# EAGLE design controller_v5 (EAGLE 7.1.0)

## Sheet 1 of 4
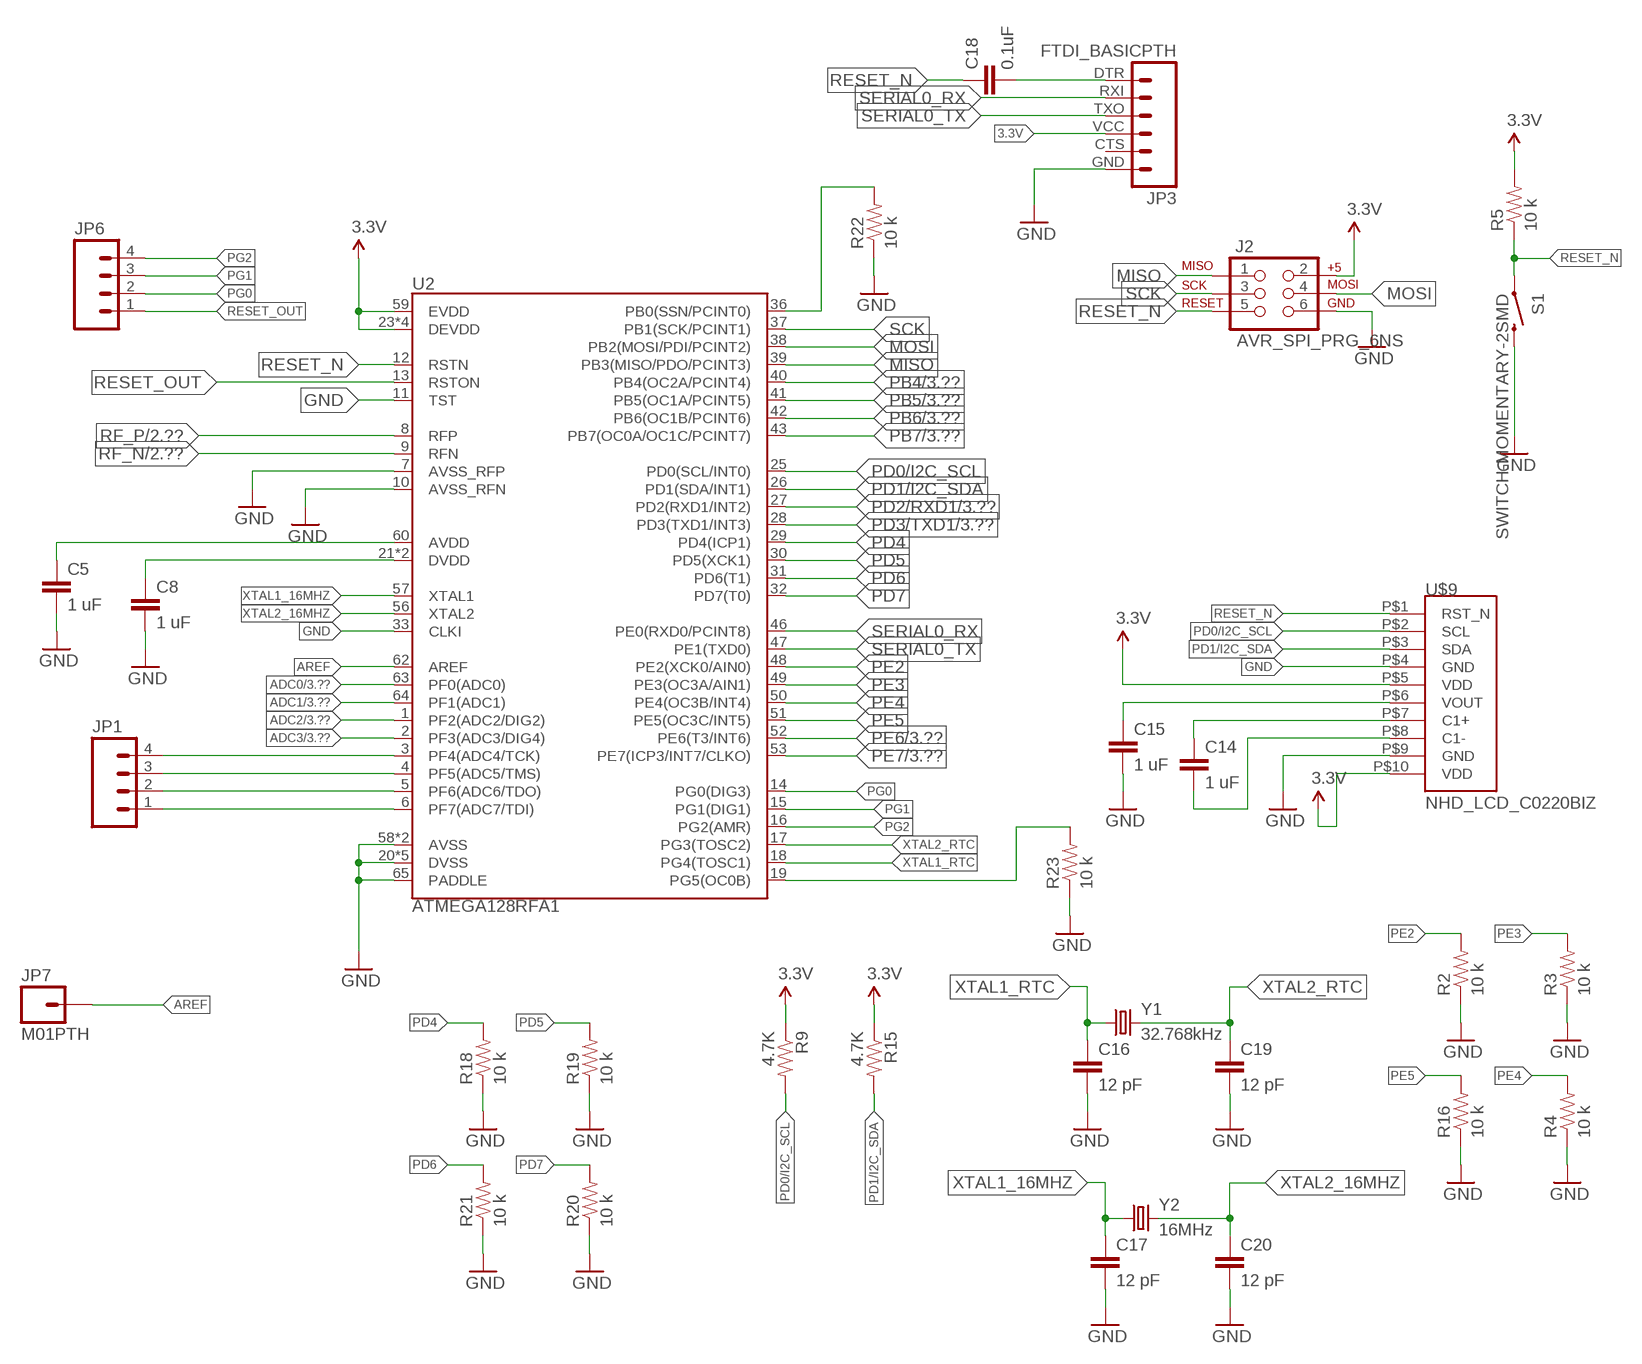
[diagram p0: schematic, sheet 1]

### Parts
C5  1 uF  CAP0805  [0805]
C8  1 uF  CAP0805  [0805]
C14  1 uF  CAP0805  [0805]
C15  1 uF  CAP0805  [0805]
C16  12 pF  CAP0805  [0805]
C17  12 pF  CAP0805  [0805]
C18  0.1uF  CAP0805  [0805]
C19  12 pF  CAP0805  [0805]
C20  12 pF  CAP0805  [0805]
J2  AVR_SPI_PRG_6NS  [2X3-NS]
JP1  M04PTH  [1X04]
JP3  FTDI_BASICPTH  [FTDI_BASIC]
JP6  M04PTH  [1X04]
JP7  M01PTH  [1X01]
R2  10 k  RESISTOR0805-RES  [0805]
R3  10 k  RESISTOR0805-RES  [0805]
R4  10 k  RESISTOR0805-RES  [0805]
R5  10 k  RESISTOR0805-RES  [0805]
R9  4.7K  RESISTOR0805-RES  [0805]
R15  4.7K  RESISTOR0805-RES  [0805]
R16  10 k  RESISTOR0805-RES  [0805]
R18  10 k  RESISTOR0805-RES  [0805]
R19  10 k  RESISTOR0805-RES  [0805]
R20  10 k  RESISTOR0805-RES  [0805]
R21  10 k  RESISTOR0805-RES  [0805]
R22  10 k  RESISTOR0805-RES  [0805]
R23  10 k  RESISTOR0805-RES  [0805]
S1  SWITCH-MOMENTARY-2SMD  [TACTILE_SWITCH_SMD]
U2  ATMEGA128RFA1  [QFN-64]
U$9  NHD_LCD_C0220BIZ  [1X08-2MMPTH-LCD]
Y1  32.768kHz  CRYSTAL32-SMD  [CRYSTAL-32KHZ-SMD]
Y2  16MHz  CRYSTAL5X3  [CRYSTAL-SMD-5X3]

### Nets
3.3V: J2.2 JP3.VCC R5.2 R9.1 R15.1 U2.23(DEVDD) U2.34(DEVDD) U2.44(DEVDD) U2.54(DEVDD) U2.59(EVDD) U$9.P$5(VDD) U$9.P$10(VDD) ; also sheet 3,4
ADC0: U2.63(PF0(ADC0)) ; also sheet 3
ADC1: U2.64(PF1(ADC1)) ; also sheet 3
ADC2: U2.1(PF2(ADC2/DIG2)) ; also sheet 3
ADC3: U2.2(PF3(ADC3/DIG4)) ; also sheet 3
ADC4: JP1.4 U2.3(PF4(ADC4/TCK))
ADC5: JP1.3 U2.4(PF5(ADC5/TMS))
ADC6: JP1.2 U2.5(PF6(ADC6/TDO))
ADC7: JP1.1 U2.6(PF7(ADC7/TDI))
AREF: JP7.1 U2.62(AREF)
GND: C5.2 C8.2 C15.2 C16.2 C17.2 C19.2 C20.2 J2.6 JP3.GND R2.1 R3.1 R4.1 R16.1 R18.1 R19.1 R20.1 R21.1 R22.1 R23.1 S1.3 U2.7(AVSS_RFP) U2.10(AVSS_RFN) U2.11(TST) U2.20(DVSS) U2.24(DVSS) U2.33(CLKI) U2.35(DVSS) U2.45(DVSS) U2.55(DVSS) U2.58(AVSS) U2.61(AVSS) U2.65(PADDLE) U$9.P$4(GND) U$9.P$9(GND) ; also sheet 2,3,4
MISO: J2.1 U2.39(PB3(MISO/PDO/PCINT3))
MOSI: J2.4 U2.38(PB2(MOSI/PDI/PCINT2))
N$2: C18.2 JP3.DTR
N$5: C14.1 U$9.P$7(C1+)
N$15: C5.1 U2.60(AVDD)
N$16: C8.1 U2.21(DVDD) U2.22(DVDD)
N$22: C14.2 U$9.P$8(C1-)
PB0: R22.2 U2.36(PB0(SSN/PCINT0))
PB1: R23.2 U2.19(PG5(OC0B))
PB4: U2.40(PB4(OC2A/PCINT4)) ; also sheet 3
PB5: U2.41(PB5(OC1A/PCINT5)) ; also sheet 3
PB6: U2.42(PB6(OC1B/PCINT6)) ; also sheet 3
PB7: U2.43(PB7(OC0A/OC1C/PCINT7)) ; also sheet 3
PD0/I2C_SCL: R9.2 U2.25(PD0(SCL/INT0)) U$9.P$2(SCL)
PD1/I2C_SDA: R15.2 U2.26(PD1(SDA/INT1)) U$9.P$3(SDA)
PD2/RXD1: U2.27(PD2(RXD1/INT2)) ; also sheet 3
PD3/TXD1: U2.28(PD3(TXD1/INT3)) ; also sheet 3
PD4: R18.2 U2.29(PD4(ICP1))
PD5: R19.2 U2.30(PD5(XCK1))
PD6: R21.2 U2.31(PD6(T1))
PD7: R20.2 U2.32(PD7(T0))
PE2: R2.2 U2.48(PE2(XCK0/AIN0))
PE3: R3.2 U2.49(PE3(OC3A/AIN1))
PE4: R4.2 U2.50(PE4(OC3B/INT4))
PE5: R16.2 U2.51(PE5(OC3C/INT5))
PE6: U2.52(PE6(T3/INT6)) ; also sheet 3
PE7: U2.53(PE7(ICP3/INT7/CLKO)) ; also sheet 3
PG0: JP6.2 U2.14(PG0(DIG3))
PG1: JP6.3 U2.15(PG1(DIG1))
PG2: JP6.4 U2.16(PG2(AMR))
RESET_N: C18.1 J2.5 R5.1 S1.1 U2.12(RSTN) U$9.P$1(RST_N)
RESET_OUT: JP6.1 U2.13(RSTON)
RF_N: U2.9(RFN) ; also sheet 2
RF_P: U2.8(RFP) ; also sheet 2
SCK: J2.3 U2.37(PB1(SCK/PCINT1))
SERIAL0_RX: JP3.RXI U2.46(PE0(RXD0/PCINT8))
SERIAL0_TX: JP3.TXO U2.47(PE1(TXD0))
VOUT: C15.1 U$9.P$6(VOUT)
XTAL1_16MHZ: C17.1 U2.57(XTAL1) Y2.1
XTAL1_RTC: C16.1 U2.18(PG4(TOSC1)) Y1.X1
XTAL2_16MHZ: C20.1 U2.56(XTAL2) Y2.3
XTAL2_RTC: C19.1 U2.17(PG3(TOSC2)) Y1.X2
Unconnected: JP3.CTS

## Sheet 2 of 4
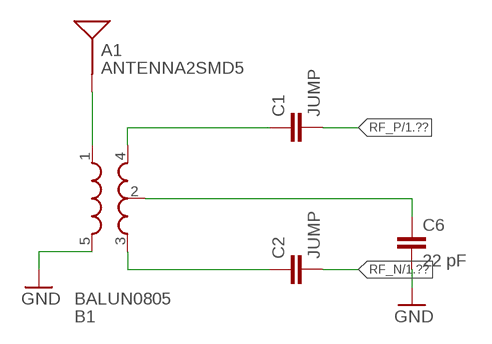
[diagram p1: schematic, sheet 2]

### Parts
A1  ANTENNA2SMD5  [ANTENNA-CHIP5]
B1  BALUN0805  [BALUN]
C1  JUMP  CAP0805  [0805]
C2  JUMP  CAP0805  [0805]
C6  22 pF  CAP0805  [0805]

### Nets
GND: B1.5(GND) C6.2 ; also sheet 1,3,4
N$9: B1.4(OUT1) C1.1
N$10: B1.3(OUT2) C2.1
N$11: B1.2(GND) C6.1
N$12: A1.FEED(SIGNAL) B1.1(IN)
RF_N: C2.2 ; also sheet 1
RF_P: C1.2 ; also sheet 1

## Sheet 3 of 4
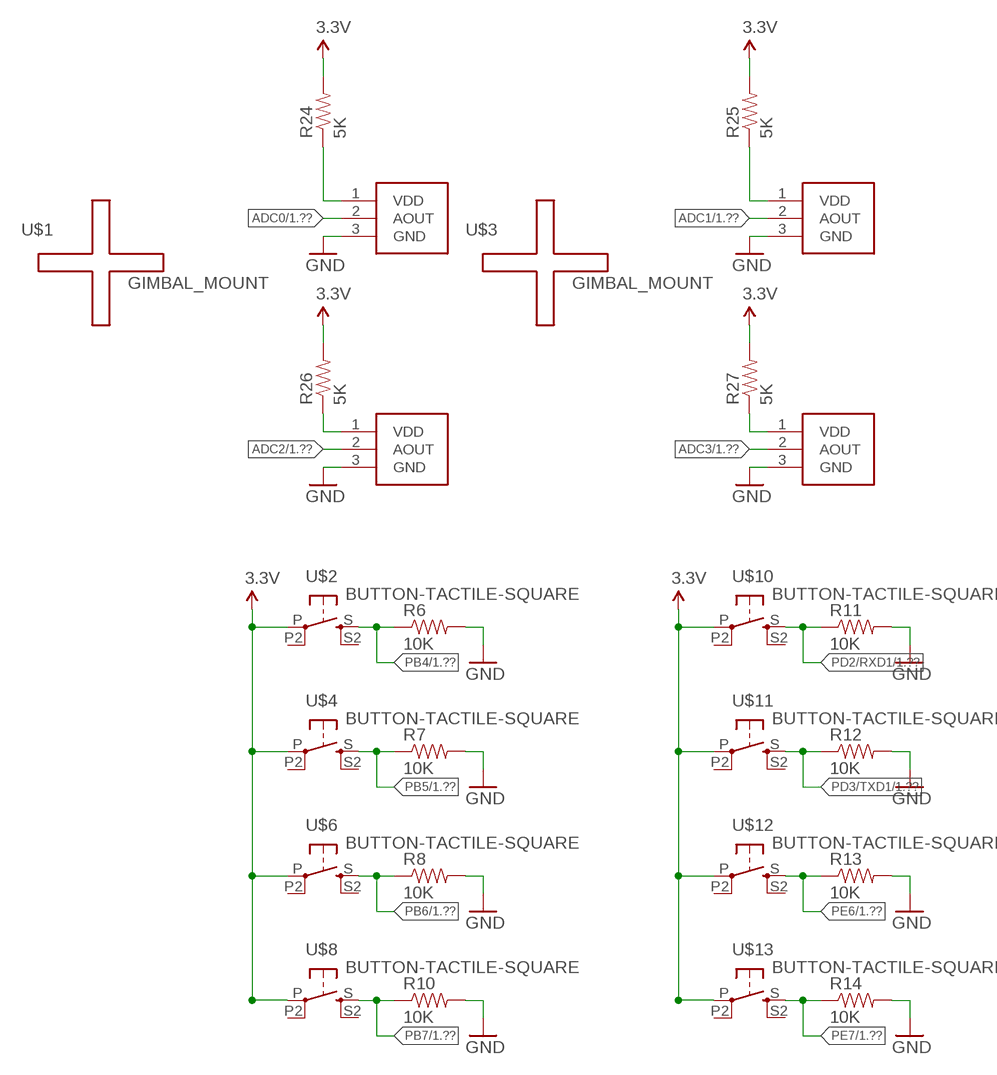
[diagram p2: schematic, sheet 3]

### Parts
J3  GIMBAL_3PIN  [JST-3-PTH]
J4  GIMBAL_3PIN  [JST-3-PTH]
J5  GIMBAL_3PIN  [JST-3-PTH]
J6  GIMBAL_3PIN  [JST-3-PTH]
R6  10K  RESISTOR0805-RES  [0805]
R7  10K  RESISTOR0805-RES  [0805]
R8  10K  RESISTOR0805-RES  [0805]
R10  10K  RESISTOR0805-RES  [0805]
R11  10K  RESISTOR0805-RES  [0805]
R12  10K  RESISTOR0805-RES  [0805]
R13  10K  RESISTOR0805-RES  [0805]
R14  10K  RESISTOR0805-RES  [0805]
R24  5K  RESISTOR0805-RES  [0805]
R25  5K  RESISTOR0805-RES  [0805]
R26  5K  RESISTOR0805-RES  [0805]
R27  5K  RESISTOR0805-RES  [0805]
U$1  GIMBAL_MOUNT  [GIMBAL_FOOTPRINT]
U$2  BUTTON-TACTILE-SQUARE  [BUTTON-TACTILE-SQUARE-ADAFRUIT1010]
U$3  GIMBAL_MOUNT  [GIMBAL_FOOTPRINT]
U$4  BUTTON-TACTILE-SQUARE  [BUTTON-TACTILE-SQUARE-ADAFRUIT1010]
U$6  BUTTON-TACTILE-SQUARE  [BUTTON-TACTILE-SQUARE-ADAFRUIT1010]
U$8  BUTTON-TACTILE-SQUARE  [BUTTON-TACTILE-SQUARE-ADAFRUIT1010]
U$10  BUTTON-TACTILE-SQUARE  [BUTTON-TACTILE-SQUARE-ADAFRUIT1010]
U$11  BUTTON-TACTILE-SQUARE  [BUTTON-TACTILE-SQUARE-ADAFRUIT1010]
U$12  BUTTON-TACTILE-SQUARE  [BUTTON-TACTILE-SQUARE-ADAFRUIT1010]
U$13  BUTTON-TACTILE-SQUARE  [BUTTON-TACTILE-SQUARE-ADAFRUIT1010]

### Nets
3.3V: R24.2 R25.2 R26.2 R27.2 U$2.P U$4.P U$6.P U$8.P U$10.P U$11.P U$12.P U$13.P ; also sheet 1,4
ADC0: J6.2(AOUT) ; also sheet 1
ADC1: J3.2(AOUT) ; also sheet 1
ADC2: J5.2(AOUT) ; also sheet 1
ADC3: J4.2(AOUT) ; also sheet 1
GND: J3.3(GND) J4.3(GND) J5.3(GND) J6.3(GND) R6.2 R7.2 R8.2 R10.2 R11.2 R12.2 R13.2 R14.2 ; also sheet 1,2,4
N$1: J6.1(VDD) R24.1
N$3: J3.1(VDD) R25.1
N$4: J5.1(VDD) R26.1
N$6: J4.1(VDD) R27.1
PB4: R6.1 U$2.S ; also sheet 1
PB5: R7.1 U$4.S ; also sheet 1
PB6: R8.1 U$6.S ; also sheet 1
PB7: R10.1 U$8.S ; also sheet 1
PD2/RXD1: R11.1 U$10.S ; also sheet 1
PD3/TXD1: R12.1 U$11.S ; also sheet 1
PE6: R13.1 U$12.S ; also sheet 1
PE7: R14.1 U$13.S ; also sheet 1
Unconnected: U$2.P2(P1) U$2.S2(S1) U$4.P2(P1) U$4.S2(S1) U$6.P2(P1) U$6.S2(S1) U$8.P2(P1) U$8.S2(S1) U$10.P2(P1) U$10.S2(S1) U$11.P2(P1) U$11.S2(S1) U$12.P2(P1) U$12.S2(S1) U$13.P2(P1) U$13.S2(S1)

## Sheet 4 of 4
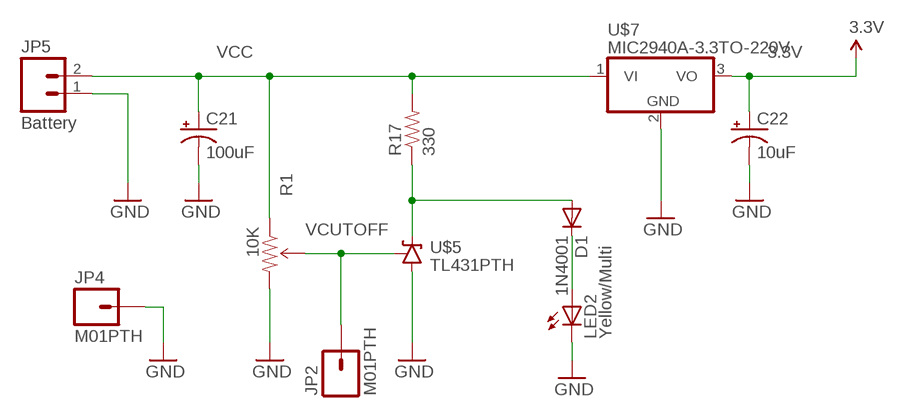
[diagram p3: schematic, sheet 4]

### Parts
C21  100uF  CPOL-USE3.5-8  [E3,5-8]
C22  10uF  CPOL-USE2.5-5  [E2,5-5]
D1  1N4001  1N4004  [DO41-10]
JP2  M01PTH  [1X01]
JP4  M01PTH  [1X01]
JP5  Battery  M02PTH  [1X02]
LED2  Yellow/Multi  LED5MM  [LED5MM]
R1  10K  TRIMPOT-PTH-KNOB  [3386U]
R17  330  RESISTORAXIAL-0.3  [AXIAL-0.3]
U$5  TL431PTH  [TO-92]
U$7  MIC2940A-3.3TO-220V  [TO-220V]

### Nets
3.3V: C22.+ U$7.3(VO) ; also sheet 1,3
GND: C21.- C22.- JP4.1 JP5.1 LED2.K(C) R1.3(CW) U$5.2(A) U$7.2(GND) ; also sheet 1,2,3
N$20: D1.A R17.P$1 U$5.3(C)
N$21: D1.C LED2.A
VCC: C21.+ JP5.2 R1.1(CCW) R17.P$2 U$7.1(VI)
VCUTOFF: JP2.1 R1.2(WIPER) U$5.1(R)

## Library data of the parts
A1 = Controller:ANTENNA2: Chip antenna Single endded antenna. Common with smaller chip antennas. CHIP4 package is the GPS Chip Antenna SKU: GPS-08418. CHIP5 package is 2.4GHz chip antenna SKU: WRL-00144.
B1 = Controller:BALUN: 0805 footprint balun- Ember 351/357
C1 C2 C5 C6 C8 C14-C20 = Controller:CAP: Capacitor Standard 0603 ceramic capacitor, and 0.1" leaded capacitor.
C21 C22 = rcl:CPOL-US: POLARIZED CAPACITOR, American symbol
D1 = diode:1N4004: DIODE general purpose rectifier, 1 A
J2 = Controller:AVR_SPI_PRG_6: AVR ISP 6 Pin This is the reduced ISP connector for AVR programming. Common on Arduino. This footprint will take up less PCB space and can be used with a 10-pin to 6-pin adapter such as SKU: BOB-08508
J3-J6 = Controller:GIMBAL_3PIN: This is the surface mount connector for the 9XR Replacement Gimbal. It uses a 3 Pin, 2 mm Pitch, JST connector (https://www.sparkfun.com/products/9750) You can see the analog transmitter here: http://www.hobbyking.com/hobbyking/store/__39505__Transmitter_Gimbal_Set_Left_Turnigy_9XR_Transmitter_Mode_1.html The black wire is VDD, the White wire is Ground, the Red wire is Analog Out Author: Dustin Richmond Created: 10/25/2014
JP1 JP6 = Controller:M04: Header 4 Standard 4-pin 0.1" header. Use with straight break away headers (SKU : PRT-00116), right angle break away headers (PRT-00553), swiss pins (PRT-00743), machine pins (PRT-00117), and female headers (PRT-00115). Molex polarized connector foot print use with SKU : PRT-08231 with associated crimp pins and housings. 1MM SMD Version SKU: PRT-10208
JP2 JP4 = SparkFun:M01: Header 1 Standard 1-pin 0.1" header. Use with straight break away headers (SKU : PRT-00116), right angle break away headers (PRT-00553), swiss pins (PRT-00743), machine pins (PRT-00117), and female headers (PRT-00115).
JP3 = Controller:FTDI_BASIC: FTDI Basic header with labels
JP5 = SparkFun:M02: Header 2 Standard 2-pin 0.1" header. Use with straight break away headers (SKU : PRT-00116), right angle break away headers (PRT-00553), swiss pins (PRT-00743), machine pins (PRT-00117), and female headers (PRT-00115). Molex polarized connector foot print use with SKU : PRT-08233 with associated crimp pins and housings.
JP7 = Controller:M01: Header 1 Standard 1-pin 0.1" header. Use with straight break away headers (SKU : PRT-00116), right angle break away headers (PRT-00553), swiss pins (PRT-00743), machine pins (PRT-00117), and female headers (PRT-00115).
LED2 = SparkFun:LED: LEDs Standard schematic elements and footprints for 5mm, 3mm, 1206, and 0603 sized LEDs. 5mm - Spark Fun Electronics SKU : COM-00529 (and others)
R1 = Controller:TRIMPOT; CREATOR: Brandon; REVIEWER1: Chris
R2-R16 R18-R27 = Controller:RESISTOR: Resistor Basic schematic elements and footprints for 0603, 1206, and PTH resistors.
R17 = SparkFun:RESISTOR: Resistor Basic schematic elements and footprints for 0603, 1206, and PTH resistors.
S1 = Controller:SWITCH-MOMENTARY-2: Various NO switches- pushbuttons, reed, etc
U2 = Controller:ATMEGA128RFA1: ATmega128RFA1 8-bit AVR Microcontroller with Low Power 2.4GHz Transceiver for ZigBee and IEEE 802.15.4
U$1 U$3 = Controller:GIMBAL_MOUNT
U$2 U$4 U$6 U$8 U$10-U$13 = Controller:BUTTON-TACTILE
U$5 = SparkFun:TL431
U$7 = SparkFun:MIC2940A-3.3: MIC2940A-3.3 Voltage Regulator 3.3V mic2940.pdf
U$9 = Controller:NHD_LCD_C0220BIZ: This is the device for the NHD‐C0220BiZ‐FSW‐FBW‐3V3M COG (Chip‐On‐Glass) Character Liquid Crystal Display Module. Datasheet: http://www.newhavendisplay.com/specs/NHD-C0220BiZ-FSW-FBW-3V3M.pdf Author: Dustin Richmond Created: 10/25/2014
Y1 Y2 = Controller:CRYSTAL: Various standard crystals. Proven footprints. Spark Fun Electronics SKU : COM-00534

## Board
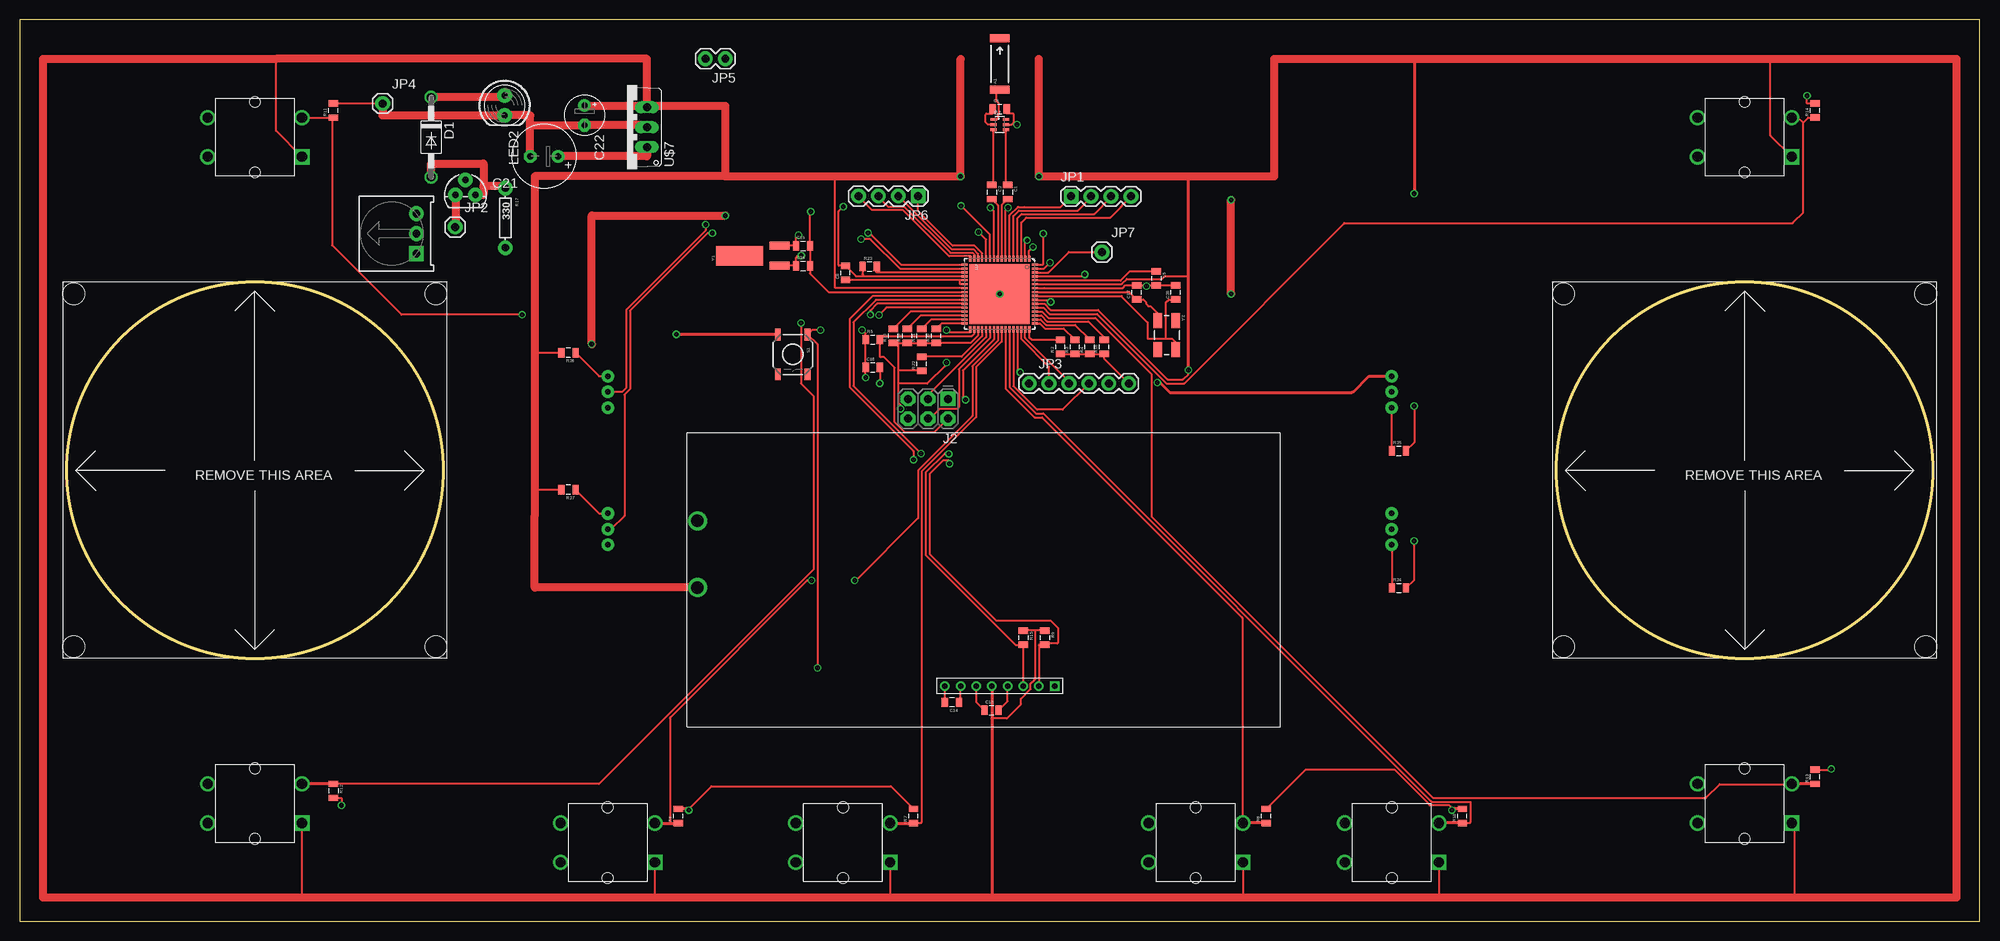
[diagram p4: board, top side]
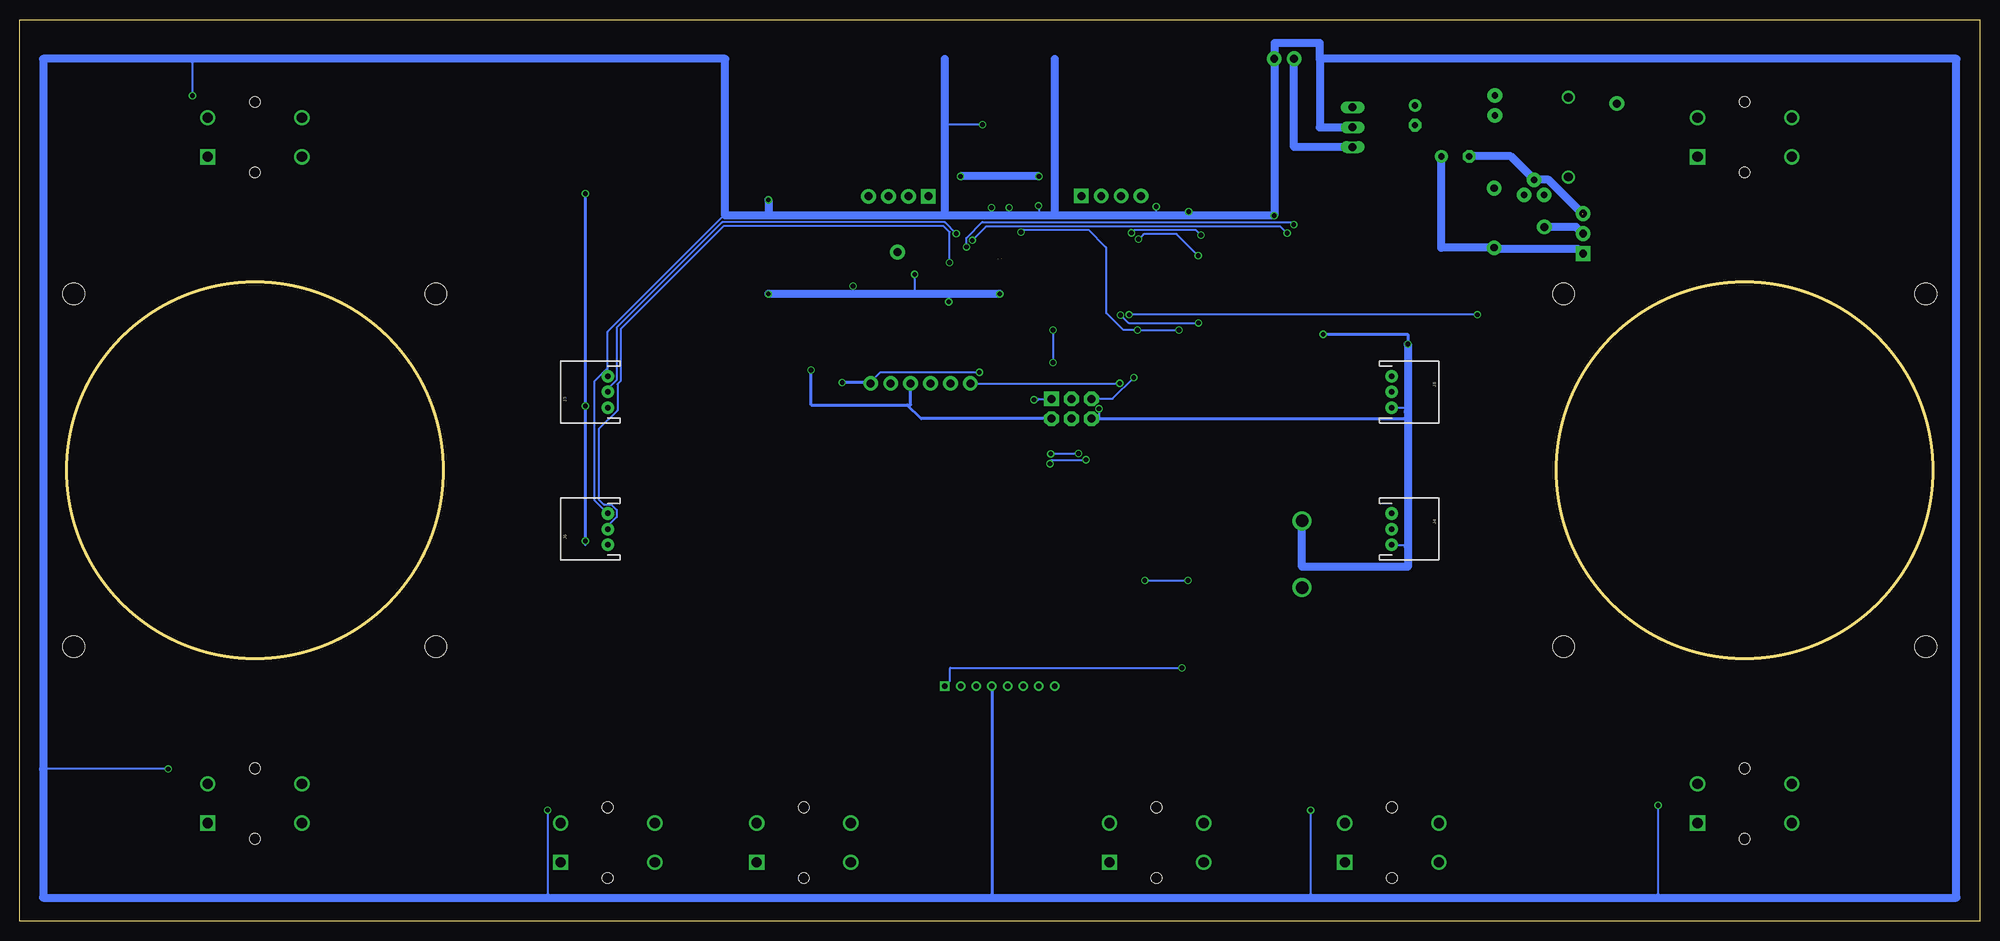
[diagram p5: board, bottom side, seen from below]

Size 250 x 115 mm. Coordinates in mm from the lower left corner, seen from the top.
Outline: 0,0 250,0 250,115 0,115 0,0
Copper layers (1*16): Top 0.035mm / dielectric 1.5mm / Bottom 0.035mm
Design rules "SeeedStudio_2layer_DRU_no_angle_20140221": minimum track width 6mil, minimum drill 12mil, track to track 6mil, track to pad 6mil, pad to pad 6mil, via to via 6mil, smd to smd 0mil, copper to edge 10mil, drill to drill 10mil, minimum pad ring 10mil, minimum via ring 6mil, stop-mask expansion 2mil, vias tented up to drill 100mil, thermal gap 10mil

### Footprints (pad centres in the part's own frame; a part is rotated, then mirrored left to right if it is on the bottom)
ANTENNA-CHIP5 = smd 1.016 x 2.54: FEED -3.302,0; NC 3.302,0
BALUN = smd 0.35 x 0.8: 1 -0.65,-0.8; 2 0,-0.8; 3 0.65,-0.8; 4 0.65,0.8; 5 0,0.8; 6 -0.65,0.8
0805 = smd 0.8 x 1.2: 1 -0.9,0; 2 0.9,0
E3,5-8 = drill 0.813 pad 1.6: + -1.778,0 | drill 0.813 pad 1.6 octagon: - 1.778,0
E2,5-5 = drill 0.813 pad 1.6: + -1.27,0 | drill 0.813 pad 1.6 octagon: - 1.27,0
DO41-10 = drill 1.118: A 5.08,0; C -5.08,0
2X3-NS = drill 1.016 pad 1.88 square: 1 -2.54,-1.27 | drill 1.016 pad 1.88 octagon: 2 -2.54,1.27; 3 0,-1.27; 4 0,1.27; 5 2.54,-1.27; 6 2.54,1.27
JST-3-PTH = drill 0.7 pad 1.6: 1 -2,0; 2 0,0; 3 2,0
1X04 = drill 1.016 pad 1.88 square: 1 0,0 | drill 1.016 pad 1.88: 2 2.54,0; 3 5.08,0; 4 7.62,0
1X01 = drill 1.016 pad 1.88: 1 0,0
FTDI_BASIC = drill 1.016 pad 1.88: CTS 10.16,0; DTR 0,0; GND 12.7,0; RXI 2.54,0; TXO 5.08,0; VCC 7.62,0
1X02 = drill 1.016 pad 1.88: 1 0,0; 2 2.54,0
LED5MM = drill 0.813 pad 1.88: A -1.27,0; K 1.27,0
3386U = drill 1.016 pad 1.88 square: 1 -2.54,-2.555 | drill 1.016 pad 1.88: 2 0,-2.555; 3 2.54,-2.555
AXIAL-0.3 = drill 0.9 pad 1.88: P$1 -3.81,0; P$2 3.81,0
TACTILE_SWITCH_SMD = smd 1.524 x 0.762: 1 -2.54,1.905; 2 2.54,1.905; 3 -2.54,-1.905; 4 2.54,-1.905
QFN-64 = smd 0.8 x 0.28: 1 -4.5,3.75; 2 -4.5,3.25; 3 -4.5,2.75; 4 -4.5,2.25; 5 -4.5,1.75; 6 -4.5,1.25; 7 -4.5,0.75; 8 -4.5,0.25; 9 -4.5,-0.25; 10 -4.5,-0.75; 11 -4.5,-1.25; 12 -4.5,-1.75; 13 -4.5,-2.25; 14 -4.5,-2.75; 15 -4.5,-3.25; 16 -4.5,-3.75; 33 4.5,-3.75; 34 4.5,-3.25; 35 4.5,-2.75; 36 4.5,-2.25; 37 4.5,-1.75; 38 4.5,-1.25; 39 4.5,-0.75; 40 4.5,-0.25; 41 4.5,0.25; 42 4.5,0.75; 43 4.5,1.25; 44 4.5,1.75; 45 4.5,2.25; 46 4.5,2.75; 47 4.5,3.25; 48 4.5,3.75 | smd 0.28 x 0.8: 17 -3.75,-4.5; 18 -3.25,-4.5; 19 -2.75,-4.5; 20 -2.25,-4.5; 21 -1.75,-4.5; 22 -1.25,-4.5; 23 -0.75,-4.5; 24 -0.25,-4.5; 25 0.25,-4.5; 26 0.75,-4.5; 27 1.25,-4.5; 28 1.75,-4.5; 29 2.25,-4.5; 30 2.75,-4.5; 31 3.25,-4.5; 32 3.75,-4.5; 49 3.75,4.5; 50 3.25,4.5; 51 2.75,4.5; 52 2.25,4.5; 53 1.75,4.5; 54 1.25,4.5; 55 0.75,4.5; 56 0.25,4.5; 57 -0.25,4.5; 58 -0.75,4.5; 59 -1.25,4.5; 60 -1.75,4.5; 61 -2.25,4.5; 62 -2.75,4.5; 63 -3.25,4.5; 64 -3.75,4.5 | smd 7.65 x 7.65: 65 0,0
GIMBAL_FOOTPRINT = hole 2.8: -23.1,22.5; -23.1,-22.5; 23.1,-22.5; 23.1,22.5
BUTTON-TACTILE-SQUARE-ADAFRUIT1010 = drill 1.3 square: P -6,2.5 | drill 1.3: P2 6,2.5; S -6,-2.5; S2 6,-2.5 | hole 1.4: 0,4.5; 0,-4.5
TO-92 = drill 0.813 pad 1.88: 1 -1.27,0; 2 0,1.905; 3 1.27,0
TO-220V = drill 1.016 long: 1 -1.27,0; 2 1.27,0; 3 3.81,0
1X08-2MMPTH-LCD = drill 0.7 square: P$1 7,0 | drill 0.7: P$2 5,0; P$3 3,0; P$4 1,0; P$5 -1,0; P$6 -3,0; P$7 -5,0; P$8 -7,0 | drill 1.6: P$9 -38.55,21.05; P$10 -38.55,12.55
CRYSTAL-32KHZ-SMD = smd 2.5 x 6: SHEILD 0,5.08 | smd 1 x 2.5: X1 -1.27,0; X2 1.27,0
CRYSTAL-SMD-5X3 = smd 1.9 x 1.1: 1 -1.85,-1.15; 2 1.85,-1.15; 3 1.85,1.15; 4 -1.85,1.15

### Placement (x,y rotation side)
A1  125,109.34 90 top
B1  125,101.6 270 top
C1  126,93 270 top
C2  124,93 270 top
C5  144.95,82 270 top
C6  125,103.6 0 top
C8  105.33,82.69 90 top
C14  118.9,27.9 180 top
C15  123.95,26.9 0 top
C16  99.91,83.6 0 top
C17  142.45,80.2 90 top
C18  108.8,70.65 0 top
C19  99.91,86.15 0 top
C20  147.45,80.2 90 top
C21  66.9,97.55 180 top
C22  72.05,102.8 270 top
D1  52.5,100 270 top
J2  115.85,65.35 180 top
J3  175,67.5 90 bottom
J4  75,50 270 bottom
J5  75,67.5 270 bottom
J6  175,50 90 bottom
JP1  134.1,92.45 0 top
JP2  55.55,88.55 0 top
JP3  128.75,68.6 0 top
JP4  46.3,104.3 0 top
JP5  90,110 180 top
JP6  114.6,92.5 180 top
JP7  138.05,85.35 0 top
LED2  61.85,104.05 270 top
R1  48.05,87.7 90 top
R2  132.75,73.25 90 top
R3  134.6,73.25 90 top
R4  136.5,73.25 90 top
R5  108.8,74.18 0 top
R6  84,13.41 90 top
R7  114,13.41 90 top
R8  159,13.41 90 top
R9  130.75,36.15 270 top
R10  184,13.41 90 top
R11  40,103.4 90 top
R12  40,16.61 270 top
R13  229,18.41 90 top
R14  229,103.41 90 top
R15  128,36.15 270 top
R16  138.3,73.25 90 top
R17  61.95,89.7 270 top
R18  111.4,74.65 90 top
R19  113.2,74.65 90 top
R20  116.9,74.65 90 top
R21  115.05,74.65 90 top
R22  115.05,71.1 90 top
R23  108.4,83.5 0 top
R24  175.9,42.5 0 top
R25  175.9,60 0 top
R26  70,72.5 180 top
R27  70,55 180 top
S1  98.6,72.29 270 top
U2  125,80 270 top
U$1  30,57.5 0 top
U$2  75,10 180 top
U$3  220,57.5 0 top
U$4  105,10 180 top
U$5  56.85,92.65 0 top
U$6  150,10 180 top
U$7  80,100 90 top
U$8  175,10 180 top
U$9  125,30 0 top
U$10  30,100 180 top
U$11  30,15 180 top
U$12  220,15 180 top
U$13  220,100 180 top
Y1  96.92,84.88 90 top
Y2  146.3,74.75 270 top

### Tracks (layer width: path | path; a pad name or v marks a point on that pad's centre or on a via)
3.3V  (via drill 0.6, 0.61)
  Top 0.254: U$11.P 36,3 | U$2.P 81,3 82,3 | U$4.P 111,3 111.1,3 | U$6.P 156,3 156.85,3 | U$8.P 181,3 181.25,3 | 65.7,52 65.7,51.75 | 65.7,69.5 65.7,69.9 | U2.34 121.75,74.95 121.45,74.65 109.7,74.65 R5.2 109.7,72 109.8,71.95 110.25,71.95 111.6,70.6 111.6,63.65 112.85,62.4 116.71,62.4 J2.2 | U2.44 126.75,68.25 129.75,65.25 133.02,65.25 JP3.VCC | U2.54 130.7,78.75 131.5,77.95 137.55,77.95 146.4,69.1 148.35,69.1 148.45,69.15 149.05,69.75 v149.05,70.3 | U2.23 104,80.75 104,94.75 104.25,95 | U$10.P 32.7,100.8 32.7,110 | R9.1 129.5,37.05 | 129.5,37.05 R15.1 | 129.5,37.05 129.5,30.85 129.4,30.8 128.95,30.35 128.95,29.6 127.7,28.35 127.7,27.7 127.65,27.6 125.9,25.85 124,25.85 | U$13.P 223.3,100.2 223.3,110 | U$12.P 226.35,12.5 226.35,3 | 149.05,82.75 149.05,82.4 148.9,82.25 146.05,82.25 145.7,81.9 141.2,81.9 140.6,81.3 140.5,81.25 U2.59 | 65.7,72.55 69.1,72.55 R26.2 | R27.2 65.7,55 | 177.85,65.5 177.85,61.05 R25.2 | R24.2 177.85,43.55 v177.85,48.5
  Top 0.406: U$9.P$5 124,25.85 124,3 124.15,3 | 177.85,110 v177.85,92.8 | 151.7,95 151.85,95 | v149.05,70.3 149.05,82.4 149.05,95 148.55,95 | 177.85,65.5 v177.85,65.7
  Top 1.016: U$7.3 80,104 | 80,104 90,104 90,95 | 90,95 104.25,95 v120,95 120,110 | 130,110 v130,95 148.55,95 151.7,95 160,95 160,110 177.85,110 223.3,110 247,110 247,3 226.35,3 181.25,3 156.85,3 124.15,3 111.1,3 82,3 36,3 3,3 3,110 32.7,110 80,110 80,104 | 90,95 65.7,95 65.7,72.55 65.7,69.9 65.7,55 65.7,51.75 65.7,42.55 U$9.P$10 | C22.+ 72.05,104 80,104
  Bottom 0.406: v177.85,92.8 v177.85,65.7 v177.85,48.5 177.85,48 | 136.8,65.85 149.05,65.85 v149.05,70.3 | 136.8,65.85 136.37,65.85 JP3.VCC | J2.2 135.03,64.08 136.8,65.85
  Bottom 1.016: v120,95 v130,95
ADC0  (via drill 0.61)
  Top 0.254: v131.4,84 130.65,83.25 U2.63
  Bottom 0.254: J6.2 175,50.4 173.85,51.55 173.85,52.45 174.55,53.15 175.5,53.15 176.15,53.8 176.15,62.75 173.75,65.15 173.75,68.5 173.35,68.9 173.35,75.55 160.25,88.65 132.15,88.65 131.4,87.9 v131.4,84
ADC1  (via drill 0.61)
  Top 0.254: v130.55,87.7 130.55,83.8 130.5,83.75 U2.64
  Bottom 0.254: J3.2 175,67.9 173.85,69.05 173.85,75.7 160.4,89.15 132,89.15 v130.55,87.7
ADC2  (via drill 0.6)
  Top 0.254: J5.2 76.85,67.5 77.35,68 77.35,78 77.45,78.05 87.5,88.1 v87.5,88.85 | v129.25,86 128.75,85.5 U2.1
  Bottom 0.254: v87.5,88.85 87.5,89.15 127.15,89.15 arc90 127.2,89.2 129.25,87.15 v129.25,86
ADC3  (via drill 0.6, 0.61)
  Top 0.254: J4.2 75.45,50 77.15,51.7 77.15,67.15 77.85,67.85 77.85,77.85 87.75,87.75 v88.35,87.75 | U2.2 128.25,86.6 v128.5,86.85
  Bottom 0.254: v88.35,87.75 89.25,88.65 126.75,88.65 126.8,88.55 v128.5,86.85
ADC4
  Top 0.254: U2.3 127.75,89.1 128.35,89.7 128.35,89.75 139.1,89.75 140.45,91.1 140.8,91.45 141.7,92.35 141.7,92.45 JP1.4
ADC5
  Top 0.254: U2.4 127.25,89.65 127.8,90.2 137.05,90.2 139.15,92.3 139.15,92.45 JP1.3
ADC6
  Top 0.254: JP1.2 136.6,92.45 136.6,92.3 134.95,90.65 127.45,90.65 126.75,89.95 U2.5
ADC7
  Top 0.254: U2.6 126.25,90.05 127.3,91.1 127.45,91.1 128.15,91.1 132.75,91.1 JP1.1
AREF
  Top 0.254: JP7.1 133.8,85.35 131.2,82.75 U2.62
GND  (via drill 0.6, 0.61)  (1 unrouted)
  Top 0.254: C6.2 125.9,103 126.7,103 126.8,102.9 126.8,101.9 126.65,101.75 | 126.65,101.75 126.5,101.6 B1.5 | v127.2,101.6 126.8,101.6 126.65,101.75 | v41.05,14.75 41.05,15.65 41,15.7 R12.2 | C15.2 126,28.05 U$9.P$4 | v85.35,14.15 85.35,14.31 88.24,17.2 111.11,17.2 R7.2 | 182.65,14.31 v182.65,14.15 182.6,14.5 182.35,14.75 179.85,14.75 179.6,15 179.6,15.1 175.35,19.35 164.04,19.35 R8.2 | 130.65,80.75 U2.58 140.7,80.75 141.05,81.1 C17.2 143.7,81.1 | U2.45 127.25,70.25 127.35,70.25 v127.6,70 | U2.65 127.75,80 128.5,79.25 | 127.25,76.5 128.45,77.7 128.45,79.15 U2.65 | 125,80.25 U2.65 | 125,82.25 U2.65 | 128.45,80.75 127.8,80.1 U2.65 | U2.24 103.15,80.25 100.8,82.6 100.8,83.5 C16.2 C19.2 100.8,86.25 100.8,90.4 v100.9,90.5 | 107.55,82.25 106.67,82.25 C8.2 105.25,83.6 104.5,83.6 104.45,83.65 104.45,90.55 v105.05,91.15 | 107.55,82.25 U2.20 | v227.95,105.3 227.95,104.35 228,104.3 R14.2 | R13.2 230.95,19.31 230.95,19.35 v231.05,19.4 | JP4.1 R11.2 | v120.05,91.25 123.75,87.55 U2.11 | U2.10 124.25,90.55 v123.8,91 | U2.7 125.75,90.7 v126.05,91 | R2.1 R3.1 R4.1 R16.1 138.3,71.75 JP3.GND | R18.1 112.05,73.75 | 112.05,73.75 R19.1 R21.1 R20.1 121.3,73.75 122.25,74.7 U2.35 | v112.35,65.35 112.35,65.85 112.05,66.15 112.05,68.5 | 112.05,73.75 112.05,70.2 | 112.05,70.2 112.05,68.5 | R22.1 112.05,70.2 | R23.1 107.5,82.5 107.55,82.45 107.55,82.25 | v118.2,71.25 118.2,70.95 118.15,70.95 115.75,68.55 112.1,68.55 112.05,68.5 | v118.2,75.4 118.5,75.1 121.2,75.1 121.25,75.15 U2.33 | U2.61 135.8,82.25 135.85,82.35 v135.85,82.5 | 143.7,81.1 C5.2 C20.2 | v143.7,81 143.7,81.1 | U2.55 131.5,79.25 v131.5,79
  Top 0.406: R10.2 182.65,14.31 | 85.35,14.31 R6.2 | v145.1,68.7 145.45,68.7 146.7,67.45 169.9,67.45 170.1,67.5 172.1,69.5 J3.3 | S1.3 83.77,74.83 v83.75,74.85
  Top 1.016: v72.95,73.6 72.95,90 v90,90 | U$7.2 80,101.53 C22.- 65.12,101.53 | C21.- 65.12,101.53 | 65.12,101.53 65.12,102.78 LED2.K 46.3,102.78 JP4.1 | v154.5,80 v154.5,92
  Bottom 0.254: v127.2,101.6 132,101.6 | v41.05,14.75 41.05,3 | v85.35,14.15 85.35,3 | v182.65,14.15 182.65,3 | J3.3 175,70.55 | 175,70.55 175,75.2 160,90.2 | J6.3 176.65,53.65 176.65,68.9 175,70.55 | J4.3 72.95,48 72.95,47.85 | J5.3 72.95,65.5 72.95,64.95 | 72.95,73.65 v72.95,73.6 | JP3.GND 141.45,68.8 140.25,70 v127.6,70 | v227.95,105.3 227.95,110 | v231.05,19.4 247,19.4 | 119.95,91.15 v120.05,91.25 120,91.05 120,90 | 126,89.95 126,90 126.05,90.05 v126.05,91 | v123.8,91 123.8,90.1 123.7,90 | v112.35,65.35 112.35,64.08 | v118.2,75.4 v118.2,71.25 | v100.9,90.5 100.9,90 | 105.05,90.8 v105.05,91.15 105.1,90.7 105.1,90 | v143.7,81 143.7,80 | v131.5,79 131.5,80 | v135.85,82.5 135.85,80
  Bottom 0.406: U$9.P$4 126,3 | J2.6 112.35,64.08 72.95,64.08 72.95,64.15 | v72.95,73.6 72.95,74.85 v83.75,74.85 | 136.05,90 135.75,90 | 144.65,90.25 144.9,90 | v145.1,68.7 141.55,68.7 JP3.GND
  Bottom 1.016: JP5.1 v90,90 100.9,90 105.1,90 118,90 | 118,90 120,90 123.7,90 126,90 132,90 | 132,90 135.75,90 144.9,90 154.5,90 | 154.5,90 160,90 160,90.2 160,110 227.95,110 247,110 247,19.4 247,3 182.65,3 126,3 85.35,3 41.05,3 3,3 3,110 84.2,110 | 132,90 132,101.6 132,110 | 118,110 118,90 | v72.95,73.6 72.95,64.95 72.95,64.15 72.95,47.85 72.95,45.2 86.45,45.2 U$9.P$9 | 84.2,110 84.2,112 89.95,112 89.95,110 | 84.2,110 84.2,101.27 U$7.2 | 50.65,90.2 55.01,94.56 U$5.2 59.84,97.55 C21.- | U2.65 131.5,80 135.85,80 143.7,80 v154.5,80 | v154.5,92 154.5,90
  other vias: 125,80
MISO  (via drill 0.61)
  Top 0.254: v120.65,66.5 120.3,66.85 120.3,70.25 124.25,74.2 U2.39
  Bottom 0.254: 120.4,66.25 v120.65,66.5 120.3,66.3 120,66.6 118.4,66.6 J2.1
MOSI
  Top 0.254: U2.38 123.75,74.35 119.8,70.4 119.8,65.6 119.55,65.35 117.35,65.35 116.1,64.1 115.85,64.1 J2.4
N$1
  Top 0.254: J6.1 R24.1
N$2  (via drill 0.61)
  Top 0.254: C18.2 v109.7,68.6
  Bottom 0.254: JP3.DTR v109.7,68.6
N$3
  Top 0.254: R25.1 J3.1
N$4
  Top 0.254: R26.1 73.9,69.5 J5.1
N$5
  Top 0.254: C14.1 120,28.1 U$9.P$7
N$6
  Top 0.254: R27.1 73.9,52 J4.1
N$9
  Top 0.254: C1.1 125.8,94.1 B1.4
N$10
  Top 0.254: C2.1 124.2,94.1 B1.3
N$11
  Top 0.254: C6.1 124.1,103 123.3,103 123.2,102.9 123.2,101.9 123.5,101.6 B1.2
N$12
  Top 0.254: A1.FEED 125,106 124.6,106 124.6,104.6 124.9,104.3 124.9,102.9 124.8,102.8 124.8,102.4 124.7,102.3 124.2,102.3 B1.1
N$15
  Top 0.254: U2.60 140.4,81.75 140.4,81.7 141.6,82.9 C5.1
N$16
  Top 0.254: U2.21 119.9,81.75 | 119.9,81.75 105.33,81.75 C8.1 | 119.9,81.75 119.9,81.3 119.95,81.25 U2.22
N$20
  Top 1.016: D1.A 52.5,96.65 59.15,96.65 59.15,93.75 | 59.15,93.75 59.15,92.65 U$5.3 | R17.P$1 61.95,93.75 59.15,93.75
N$21
  Top 1.016: LED2.A 61.85,105.08 D1.C
N$22
  Top 0.254: C14.2 U$9.P$8
PB0
  Top 0.254: R22.2 120.15,72 122.75,74.6 U2.36
PB1
  Top 0.254: U2.19 109.3,82.75 R23.2
PB4  (via drill 0.6)
  Top 0.254: 82.95,12.5 82.95,25.9 83,26 100.45,43.45 v101,43.45 | U2.40 124.75,74.05 121.5,70.8 121.5,64.45 121.45,64.35 114.6,57.5 114.6,51.4 106.6,43.4 v106.5,43.45
  Top 0.406: U$2.S 82.95,12.5 R6.1
  Bottom 0.254: v106.5,43.45 v101,43.45
PB5
  Top 0.254: U2.41 125.25,73.9 122,70.65 122,64.3 115.05,57.35 115.05,12.65 114.9,12.5 114.2,12.5 R7.1
  Top 0.406: U$4.S R7.1
PB6
  Top 0.254: U$6.S 155.95,12.7 155.95,38.65 155.9,38.75 130.4,64.25 129.45,64.25 125.75,67.95 U2.42
  Top 0.406: R8.1 U$6.S
PB7
  Top 0.254: R10.1 184.2,12.5 184.9,12.5 185.05,12.65 185.05,15.2 180.05,15.2 180,15.3 130.55,64.75 129.6,64.75 126.25,68.1 U2.43
  Top 0.406: R10.1 U$8.S
PD0/I2C_SCL  (via drill 0.61)
  Top 0.254: U2.25 108.8,79.75 105.85,76.8 105.85,68.1 114,59.95 v114,58.85 | 118.6,58.7 v118.6,58.35 118.5,58.75 117.75,58.75 116.05,57.05 116.05,46.85 124.55,38.35 131.45,38.35 132.4,37.4 132.4,35.5 132.3,35.4 130.9,35.4 R9.2 130.05,35.25 130,35.2 U$9.P$2
  Bottom 0.254: v114,58.85 114.1,58.75 118.45,58.75 118.5,58.65 118.6,58.55 v118.6,58.35
PD1/I2C_SDA  (via drill 0.6, 0.61)
  Top 0.254: U$9.P$3 R15.2 127,35.25 115.55,46.7 115.55,57.2 118,59.65 118.05,59.6 v118.5,59.6 | U2.26 109.2,79.25 106.35,76.4 106.35,68.3 106.4,68.2 v114.95,59.65
  Bottom 0.254: v118.5,59.6 115.4,59.6 115.3,59.65 v114.95,59.65
PD2/RXD1  (via drill 0.61)
  Top 0.254: v108.5,77.35 108.5,77.9 109.35,78.75 U2.27 | U$10.S R11.1 39.85,102.35 39.85,86.2 48.7,77.35 v64.1,77.35
  Bottom 0.254: v64.1,77.35 v108.5,77.35
PD3/TXD1  (via drill 0.6)
  Top 0.254: U2.28 110.5,78.25 110.45,78.15 v109.6,77.3 | v99.65,76.3 99.65,68.6 101.25,67 101.25,44.85 73.9,17.5 40.2,17.5 R12.1
  Top 0.406: R12.1 U$11.S
  Bottom 0.254: v99.65,76.3 108.55,76.3 108.65,76.35 v109.6,77.3
PD4
  Top 0.254: U2.29 113.6,77.75 R18.2
PD5
  Top 0.254: U2.30 114.9,77.25 R19.2
PD6
  Top 0.254: U2.31 116.25,76.75 R21.2
PD7
  Top 0.254: U2.32 117.6,76.25 R20.2
PE2
  Top 0.254: R2.2 129.1,74.15 128.75,74.5 U2.48
PE3
  Top 0.254: U2.49 130.1,76.25 130.75,75.6 133.15,75.6 R3.2
PE4
  Top 0.254: U2.50 130.2,76.75 130.9,76.05 134.6,76.05 R4.2
PE5
  Top 0.254: U2.51 130.3,77.25 131.05,76.5 136.3,76.5 138.3,74.5 R16.2
PE6
  Top 0.254: U2.52 130.4,77.75 131.2,76.95 137.2,76.95 144.4,69.75 144.35,69.65 144.35,51.6 180.25,15.7 215.05,15.7 216.8,17.45 225.8,17.45 U$12.S
  Top 0.406: R13.1 U$12.S
PE7
  Top 0.254: U2.53 130.55,78.25 131.35,77.45 137.4,77.45 146.25,68.6 148.55,68.6 168.9,88.95 168.95,89.05 226.15,89.05 226.2,89.15 227.45,90.4 227.45,101.85 | 227.45,101.85 228.1,102.5 R14.1 | 227.45,101.85 226.8,102.5 U$13.S
PG0
  Top 0.254: JP6.2 118.86,85.7 121.65,85.7 122.25,85.1 U2.14
PG1
  Top 0.254: U2.15 121.75,85 121.5,85.25 118.7,85.25 112.8,91.15 110.75,91.15 109.55,92.35 109.55,92.5 JP6.3
PG2
  Top 0.254: U2.16 121.25,84.8 118.55,84.8 112.65,90.7 108.7,90.7 108.25,91.15 107.6,91.8 107,92.4 107,92.5 JP6.4
RESET_N  (via drill 0.6, 0.61)
  Top 0.254: v101.75,32.3 101.75,73.58 S1.1 101.08,75.4 v102.15,75.4 | v107.45,75.4 107.9,74.95 R5.1 C18.1 v107.9,69.35 | U2.12 123.25,86.95 v122.3,87.9
  Bottom 0.254: v101.75,32.3 131.3,32.3 131.35,32.2 131.35,30.65 U$9.P$1 | v102.15,75.4 v107.45,75.4 109.25,75.4 111.4,77.55 111.4,85.95 111.5,86 113.7,88.2 122,88.2 v122.3,87.9 | v107.9,69.35 110.6,66.65 113.3,66.65 J2.5
RESET_OUT
  Top 0.254: JP6.1 114.6,90.55 119,86.15 121.8,86.15 122.75,85.2 U2.13
RF_N  (1 unrouted)
  Top 0.254: C2.2 124.77,91.33 124.77,84.5
RF_P  (1 unrouted)
  Top 0.254: C1.2 125.23,91.33 125.23,84.5
SCK
  Top 0.254: J2.3 115.85,67.1 123.25,74.5 U2.37
SERIAL0_RX
  Top 0.254: U2.46 127.75,74.25 131.3,70.7 JP3.RXI
SERIAL0_TX
  Top 0.254: U2.47 128.25,74.4 133.8,68.85 133.8,68.6 JP3.TXO
VCC
  Top 1.016: U$7.1 80,97.55 C21.+
  Bottom 1.016: C21.+ 68.68,85.89 R17.P$2 61.45,85.7 51.15,85.7 50.65,85.2 R1.1 | U$7.1 87.46,98.73 JP5.2
VCUTOFF
  Top 1.016: U$5.1 55.58,88.55 JP2.1
  Bottom 1.016: JP2.1 51.5,88.55 50.65,87.7 R1.2
VOUT
  Top 0.254: U$9.P$6 122,27.95 C15.1
XTAL1_16MHZ
  Top 0.254: Y2.1 145.15,77.5 144.2,78.45 143.95,78.45 143.65,78.75 143.65,78.95 143.3,79.3 C17.1 141.5,80.25 U2.57
XTAL1_RTC  (via drill 0.6, 0.61)
  Top 0.254: Y1.X1 C16.1 99,83.7 99,84.6 99.3,84.9 v99.7,84.9 | U2.18 112.25,83.25 108.55,86.95 108.45,87 v107.3,87
  Bottom 0.254: v99.7,84.9 102.45,87.65 106.6,87.65 106.7,87.6 v107.3,87
XTAL2_16MHZ
  Top 0.254: Y2.3 147.45,73.8 146.95,74.3 146.2,74.3 | 146.2,74.3 143.85,74.3 143.85,76.35 140.55,79.65 140.55,79.75 U2.56 | C20.1 146.55,79.3 146.2,78.95 146.2,74.3
XTAL2_RTC  (via drill 0.61)
  Top 0.254: Y1.X2 C19.1 99,86.25 99,87.15 v99.35,87.5 | U2.17 112.4,83.75 108.35,87.8 v108.2,87.8
  Bottom 0.254: v108.2,87.8 107.85,88.15 100,88.15 v99.35,87.5